# Altium project CM3_IO_V1.3_20220328.PrjPcb
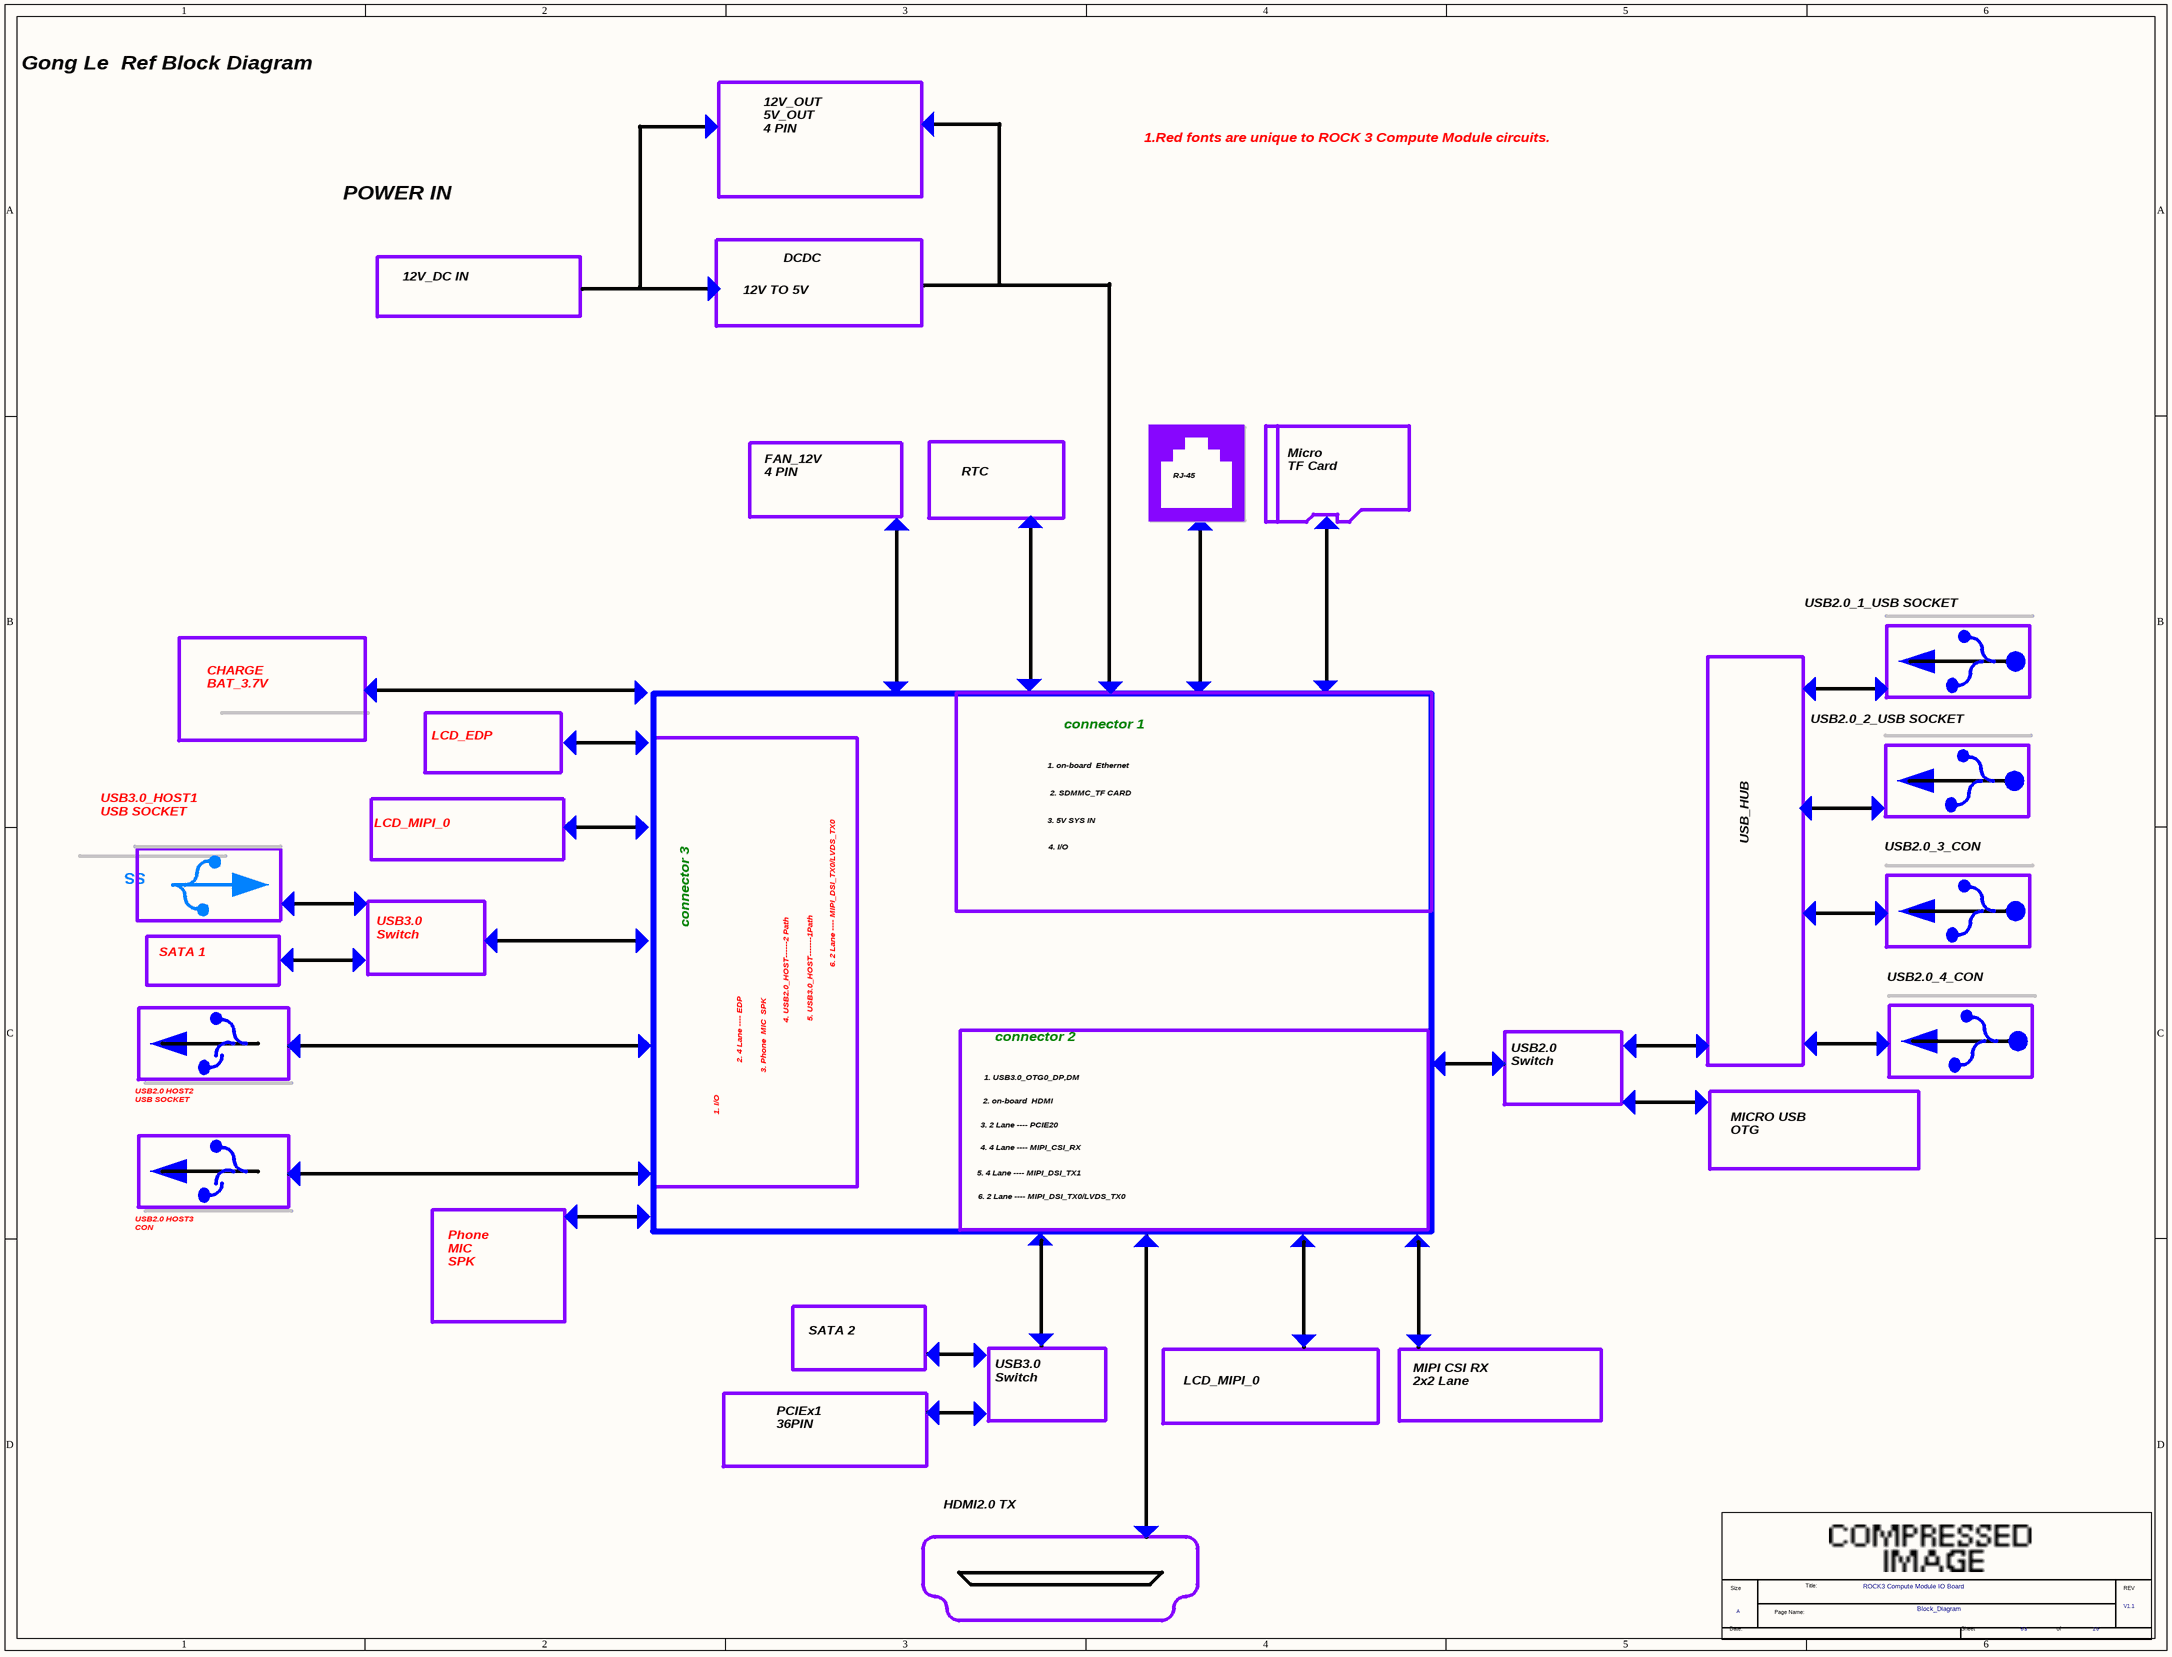
[diagram p0: 03.SchDoc]
5 sheets, 138 parts. Net scope: global (net labels, ports and power ports of the same name join across sheets).
Sheets:
  03.SchDoc
  04.SchDoc
  09.SchDoc
  13.SchDoc
  14.SchDoc

## Sheet 03.SchDoc
size 459 x 350 mm

### Parts
(Parts that share a designator on the sheet are numbered #1, #2 ... from top to bottom, then left to right.)
*#1  Page Count: 20  Page Number: 03  Page Size: A  Title: ROCK3 Compute Module IO Board  RevCode: V1.1  Doc: Block_Diagram  (hidden comment: radxa_gong)  (graphical)

### Notes on the sheet
- Gong Le  Ref Block Diagram
- 12V_OUT
  5V_OUT
  4 PIN
- 1.Red fonts are unique to ROCK 3 Compute Module circuits.
- POWER IN
- 12V_DC IN
- 12V TO 5V
- DCDC
- FAN_12V
  4 PIN
- RTC
- RJ-45
- Micro
  TF Card
- CHARGE
  BAT_3.7V
- USB2.0_1_USB SOCKET
- LCD_EDP
- 1. on-board  Ethernet
- connector 1
- USB2.0_2_USB SOCKET
- USB3.0_HOST1
  USB SOCKET
- LCD_MIPI_0
- 3. 5V SYS IN
- 2. SDMMC_TF CARD
- USB_HUB
- SS
- 4. I/O
- USB2.0_3_CON
- SATA 1
- USB3.0
  Switch
- connector 3
- 5. USB3.0_HOST-------1Path
- 6. 2 Lane ---- MIPI_DSI_TX0/LVDS_TX0
- USB2.0_4_CON
- 2. 4 Lane ---- EDP
- 3. Phone  MIC  SPK
- 4. USB2.0_HOST------2 Path
- 1. USB3.0_OTG0_DP,DM
- connector 2
- USB2.0
  Switch
- USB2.0 HOST2
  USB SOCKET
- 1. I/O
- 3. 2 Lane ---- PCIE20
- 2. on-board  HDMI
- MICRO USB
  OTG
- 5. 4 Lane ---- MIPI_DSI_TX1
- 4. 4 Lane ---- MIPI_CSI_RX
- USB2.0 HOST3
  CON
- Phone
  MIC
  SPK
- SATA 2
- MIPI CSI RX
  2x2 Lane
- PCIEx1
  36PIN
- HDMI2.0 TX
- (in symbol radxa_gong) Size; Title:; REV; Page Name:; Date:; Sheet; of

### Library data of the parts
*#1 = radxa_gong: Page Create Date: March  8, 1995

## Sheet 04.SchDoc
size 297 x 209 mm
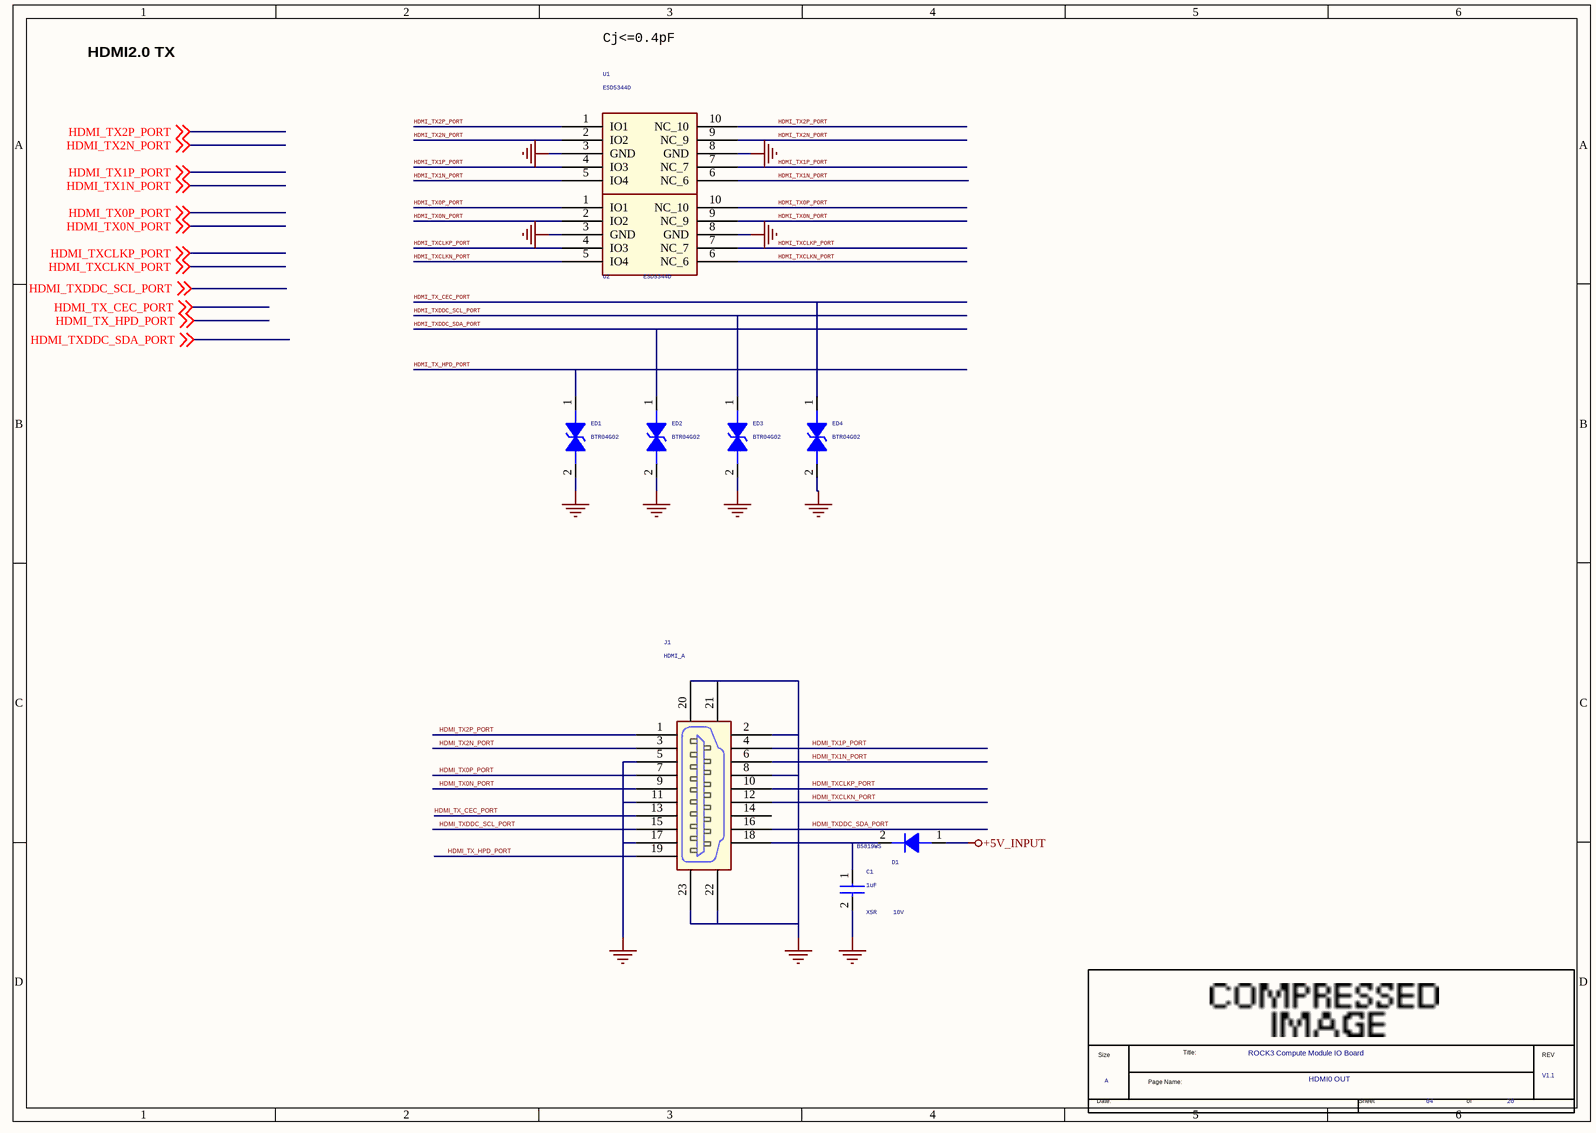
[diagram p1: 04.SchDoc]

### Parts
(Parts that share a designator on the sheet are numbered #1, #2 ... from top to bottom, then left to right.)
*#2  Page Count: 20  Page Number: 04  Page Size: A  Title: ROCK3 Compute Module IO Board  RevCode: V1.1  Doc: HDMI0 OUT  (hidden comment: radxa_gong)  (graphical)
C1  1uF  Voltage: 10V  Dielectric: X5R  [C0402]
D1  B5819WS  [SOD_323]
ED1  BTR04G02  [ESD0402_1xD5]
ED2  BTR04G02  [ESD0402_1xD5]
ED3  BTR04G02  [ESD0402_1xD5]
ED4  BTR04G02  [ESD0402_1xD5]
J1  HDMI_A  [HDMIA19S]
U1  ESD5344D  [SON10_2R50X1R00X0R50]
U2  ESD5344D  [SON10_2R50X1R00X0R50]

### Nets
+5V_INPUT: D1.1(A)
GND: C1.2 ED1.2 ED2.2 ED3.2 ED4.2 J1.2 J1.5 J1.8 J1.11 J1.17 J1.20 J1.21 J1.22 J1.23 U1.3(GND) U1.8(GND) U2.3(GND) U2.8(GND)
HDMI_TX0N_PORT: J1.9 U2.2(IO2) U2.9(NC_9) ; off-sheet HDMI_TX0N_PORT
HDMI_TX0P_PORT: J1.7 U2.1(IO1) U2.10(NC_10) ; off-sheet HDMI_TX0P_PORT
HDMI_TX1N_PORT: J1.6 U1.5(IO4) U1.6(NC_6) ; off-sheet HDMI_TX1N_PORT
HDMI_TX1P_PORT: J1.4 U1.4(IO3) U1.7(NC_7) ; off-sheet HDMI_TX1P_PORT
HDMI_TX2N_PORT: J1.3 U1.2(IO2) U1.9(NC_9) ; off-sheet HDMI_TX2N_PORT
HDMI_TX2P_PORT: J1.1($PIN0) U1.1(IO1) U1.10(NC_10) ; off-sheet HDMI_TX2P_PORT
HDMI_TX_CEC_PORT: ED4.1 J1.13 ; off-sheet HDMI_TX_CEC_PORT
HDMI_TX_HPD_PORT: ED1.1 J1.19 ; off-sheet HDMI_TX_HPD_PORT
HDMI_TXCLKN_PORT: J1.12 U2.5(IO4) U2.6(NC_6) ; off-sheet HDMI_TXCLKN_PORT
HDMI_TXCLKP_PORT: J1.10 U2.4(IO3) U2.7(NC_7) ; off-sheet HDMI_TXCLKP_PORT
HDMI_TXDDC_SCL_PORT: ED3.1 J1.15 ; off-sheet HDMI_TXDDC_SCL_PORT
HDMI_TXDDC_SDA_PORT: ED2.1 J1.16 ; off-sheet HDMI_TXDDC_SDA_PORT
NetC1_1: C1.1 D1.2(K) J1.18

Not connected (* = marked no-connect by the designer): J1 14

### Notes on the sheet
- HDMI2.0 TX
- Cj<=0.4pF
- (in symbol radxa_gong) Size; Title:; REV; Page Name:; Date:; Sheet; of

### Library data of the parts
C1 = CAP NP_Dup2: cap,1.00uF,+/-10%,10V,X5R,C0402; Manufacturer PN: C1005X5R1A105K050BB; Manufacturer: TDK; Tolerance: 10%; Priority: A; Created by: JJJ; Part Type: C0402; RK PN: C1005X5R1A105K050BB
D1 = DIODE_Dup2: Schottky Barrier，B5819WS SOD-323; Manufacturer: 长电; Priority: A; RK PN: B5819WS; Part Type: Schottky rectifier; Manufacturer PN: B5819WS; Created by: JJJ
ED1-ED4 = DIODE BI_DIR TRIG: 1-Line, Bi-directional, Transient Voltage Suppressors.17.5pF.; Manufacturer: WillSemi(韦尔半导体); RK PN: ESD5451N; Priority: A; Part Type: ESD_TVS; Manufacturer PN: ESD5451N; Created by: JJJ
J1 = HDMI_A: 通用A型HDMI座,卧式,侧插; Manufacturer: 旺科达; Priority: A; RK PN: HDMI_A; Part Type: HDMI Jack; Manufacturer Part Number: HDMI_A; Created by: JJJ
U1 U2 = ESD_ESD5304D: 4-Lines, Uni-directional, Ultra-low Capacitance Transient Voltage Suppressors; Manufacturer: WillSemi(韦尔半导体); Priority: A; Created by: JJJ; Manufacturer PN: ESD5304D; Part Type: ESD_TVS; RK PN: ESD5304D
*#2 = radxa_gong: Page Create Date: March  8, 1995

## Sheet 09.SchDoc
size 297 x 209 mm
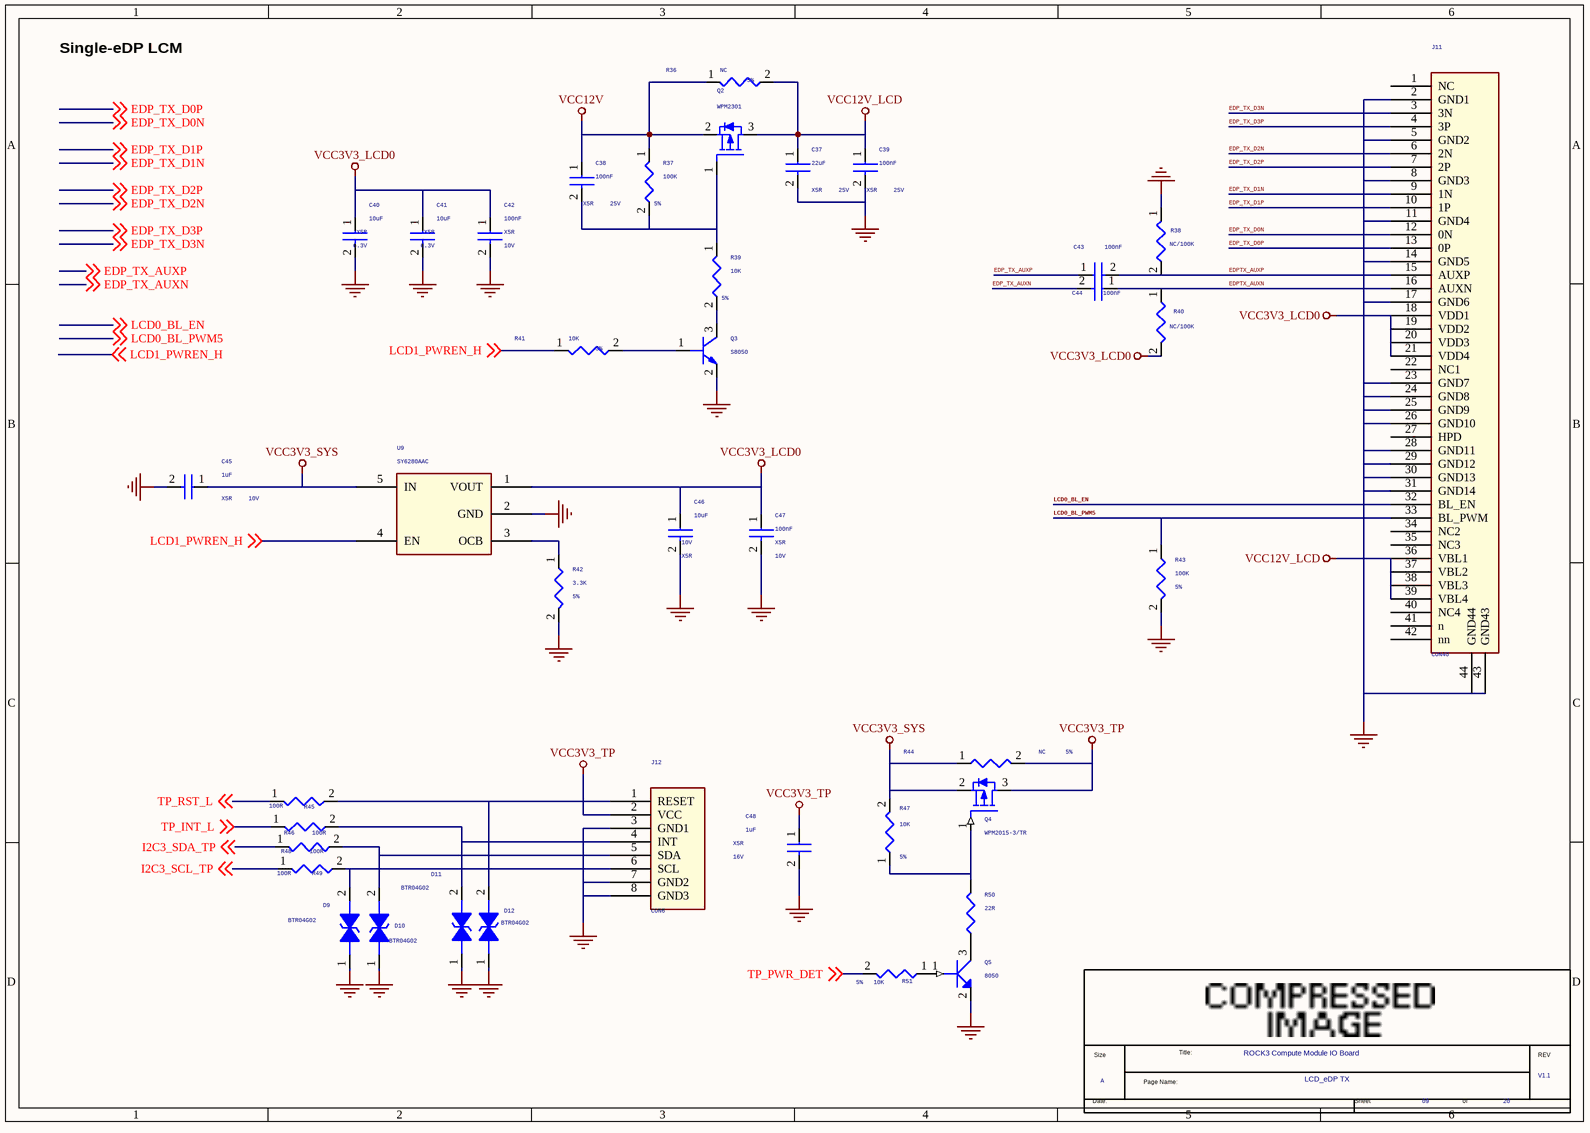
[diagram p2: 09.SchDoc]

### Parts
(Parts that share a designator on the sheet are numbered #1, #2 ... from top to bottom, then left to right.)
*#3  Page Count: 20  Page Number: 09  Page Size: A  Title: ROCK3 Compute Module IO Board  RevCode: V1.1  Doc: LCD_eDP TX  (hidden comment: radxa_gong)  (graphical)
C37  22uF  Voltage: 25V  Dielectric: X5R  [C0805]
C38  100nF  Voltage: 25V  Dielectric: X5R  [C0402]
C39  100nF  Voltage: 25V  Dielectric: X5R  [C0402]
C40  10uF  Voltage: 6.3V  Dielectric: X5R  [C0603]
C41  10uF  Voltage: 6.3V  Dielectric: X5R  [C0603]
C42  100nF  Voltage: 10V  Dielectric: X5R  [C0402]
C43  100nF  [C0402]
C44  100nF  [C0402]
C45  1uF  Voltage: 10V  Dielectric: X5R  [C0402]
C46  10uF  Voltage: 10V  Dielectric: X5R  [C0603]
C47  100nF  Voltage: 10V  Dielectric: X5R  [C0402]
C48  1uF  Voltage: 16V  Dielectric: X5R  [C0402]
D9  BTR04G02  [ESD0402_1xD5]
D10  BTR04G02  [ESD0402_1xD5]
D11  BTR04G02  [ESD0402_1xD5]
D12  BTR04G02  [ESD0402_1xD5]
J11  CON40  [20455-040E-TOP]
J12  CON6  [FPC6-0.5MM-2660H]
Q2  WPM2301  [SOT23]
Q3  S8050  [SOT23]
Q4  WPM2015-3/TR  [SOT23]
Q5  8050  [SOT23]
R36  NC  Tolerance: 5%  [R0402]
R37  100K  Tolerance: 5%  [R0402]
R38  NC/100K  [R0402]
R39  10K  Tolerance: 5%  [R0402]
R40  NC/100K  [R0402]
R41  10K  Tolerance: 5%  [R0402]
R42  3.3K  Tolerance: 5%  [R0402]
R43  100K  Tolerance: 5%  [R0402]
R44  NC  Tolerance: 5%  [R0402]
R45  100R  [R0402]
R46  100R  [R0402]
R47  10K  Tolerance: 5%  [R0402]
R48  100R  [R0402]
R49  100R  [R0402]
R50  22R  [R0402]
R51  10K  Tolerance: 5%  [R0402]
U9  SY6280AAC  [SOT_23_5]

### Nets
GND: C37.2 C39.2 C40.2 C41.2 C42.2 C45.2 C46.2 C47.2 C48.2 D9.1 D10.1 D11.1 D12.1 J11.2(GND1) J11.5(GND2) J11.8(GND3) J11.11(GND4) J11.14(GND5) J11.17(GND6) J11.23(GND7) J11.24(GND8) J11.25(GND9) J11.26(GND10) J11.28(GND11) J11.29(GND12) J11.30(GND13) J11.31(GND14) J11.43(GND43) J11.44(GND44) J12.3(GND1) J12.7(GND2) J12.8(GND3) Q3.2(EMITTER) Q5.2(E) R38.1 R42.2 R43.2 U9.2(GND)
VCC3V3_LCD0: C40.1 C41.1 C42.1 C46.1 C47.1 J11.18(VDD1) J11.19(VDD2) J11.20(VDD3) J11.21(VDD4) R40.2 U9.1(VOUT)
VCC3V3_SYS: C45.1 Q4.2(SOURCE) R44.1 R47.2 U9.5(IN)
VCC3V3_TP: C48.1 J12.2(VCC) Q4.3(DRAIN) R44.2
VCC12V: C38.1 Q2.2(SOURCE) R36.1 R37.1
VCC12V_LCD: C37.1 C39.1 J11.36(VBL1) J11.37(VBL2) J11.38(VBL3) J11.39(VBL4) Q2.3(DRAIN) R36.2
EDP_TX_AUXN: C44.2 ; off-sheet EDP_TX_AUXN
EDP_TX_AUXP: C43.1 ; off-sheet EDP_TX_AUXP
EDP_TX_D0N: J11.12(0N) ; off-sheet EDP_TX_D0N
EDP_TX_D0P: J11.13(0P) ; off-sheet EDP_TX_D0P
EDP_TX_D1N: J11.9(1N) ; off-sheet EDP_TX_D1N
EDP_TX_D1P: J11.10(1P) ; off-sheet EDP_TX_D1P
EDP_TX_D2N: J11.6(2N) ; off-sheet EDP_TX_D2N
EDP_TX_D2P: J11.7(2P) ; off-sheet EDP_TX_D2P
EDP_TX_D3N: J11.3(3N) ; off-sheet EDP_TX_D3N
EDP_TX_D3P: J11.4(3P) ; off-sheet EDP_TX_D3P
EDPTX_AUXN: C44.1 J11.16(AUXN) R40.1
EDPTX_AUXP: C43.2 J11.15(AUXP) R38.2
I2C3_SCL_TP: R49.1 ; off-sheet I2C3_SCL_TP
I2C3_SDA_TP: R48.1 ; off-sheet I2C3_SDA_TP
LCD0_BL_EN: J11.32(BL_EN) ; off-sheet LCD0_BL_EN
LCD0_BL_PWM5: J11.33(BL_PWM) R43.1 ; off-sheet LCD0_BL_PWM5
LCD1_PWREN_H: R41.1 U9.4(EN) ; off-sheet LCD1_PWREN_H
TP_INT_L: R46.1 ; off-sheet TP_INT_L
TP_PWR_DET: R51.2 ; off-sheet TP_PWR_DET
TP_RST_L: R45.1 ; off-sheet TP_RST_L
NetC38_2: C38.2 Q2.1(GATE) R37.2 R39.1
NetD9_2: D9.2 J12.6(SCL) R49.2
NetD10_2: D10.2 J12.5(SDA) R48.2
NetD11_2: D11.2 J12.4(INT) R46.2
NetD12_2: D12.2 J12.1(RESET) R45.2
NetQ3_1: Q3.1(BASE) R41.2
NetQ3_3: Q3.3(COLLECTOR) R39.2
NetQ4_1: Q4.1(GATE) R47.1 R50.2
NetQ5_1: Q5.1(B) R51.1
NetQ5_3: Q5.3(C) R50.1
NetR42_1: R42.1 U9.3(OCB)

Not connected (* = marked no-connect by the designer): J11 1(NC) 22(NC1) 27(HPD) 34(NC2) 35(NC3) 40(NC4) 41(n) 42(nn)

### Notes on the sheet
- Single-eDP LCM
- (in symbol radxa_gong) Size; Title:; REV; Page Name:; Date:; Sheet; of

### Library data of the parts
C37 C40 C41 = CAP NP_Dup2: cap,10.00uF,+/-10%,6.3V,X5R,C0603; Manufacturer PN: C1608X5R0J106K080AB; Manufacturer: TDK; Tolerance: 10%; Priority: A; Created by: JJJ; Part Type: C0603; RK PN: C1608X5R0J106K080AB
  C40 C41: C_Voltage: 6.3V
C38 = CAP NP_Dup2: cap,100.00nF,+/-10%,16V,X5R,C0402; Manufacturer: TDK; RK PN: C1005X5R1C104K050BA; Priority: A; Tolerance: 10%; Part Type: C0402; Manufacturer PN: C1005X5R1C104K050BA; Created by: JJJ
C39 = CAP NP_Dup2: cap,100.00nF,+/-10%,16V,X5R,C0402; Manufacturer PN: C1005X5R1C104K050BA; Manufacturer: TDK; Tolerance: 10%; Priority: A; Created by: JJJ; Part Type: C0402; RK PN: C1005X5R1C104K050BA
C42 C43 = CAP NP_Dup2: cap,100.00nF,+/-10%,10V,X5R,C0402; Manufacturer: TDK; RK PN: C1005X5R1A104K050BA; Priority: A; Tolerance: 10%; Part Type: C0402; Manufacturer PN: C1005X5R1A104K050BA; Created by: JJJ
  C43: Voltage: 10V; Dielectric: X5R
C44 C47 = CAP NP_Dup2: cap,100.00nF,+/-10%,10V,X5R,C0402; Manufacturer PN: C1005X5R1A104K050BA; Manufacturer: TDK; Tolerance: 10%; Priority: A; Created by: JJJ; Part Type: C0402; RK PN: C1005X5R1A104K050BA
  C44: Voltage: 10V; Dielectric: X5R
C45 = CAP NP_Dup2: cap,1.00uF,+/-10%,10V,X5R,C0402; Manufacturer PN: C1005X5R1A105K050BB; Manufacturer: TDK; Tolerance: 10%; C_Voltage: 6.3V; Priority: A; Created by: JJJ; Part Type: C0402; RK PN: C1005X5R1A105K050BB
C46 = CAP NP_Dup2: cap,10.00uF,+/-10%,10V,X5R,C0603; Manufacturer: TDK; RK PN: C1608X5R1A106K080AC; Priority: A; Tolerance: 10%; Part Type: C0603; Manufacturer PN: C1608X5R1A106K080AC; Created by: JJJ
C48 = CAP NP_Dup2: cap,100.00nF,+/-10%,6.3V,X5R,C0402; Manufacturer PN: C1005X5R0J104K050BA; Manufacturer: TDK; Tolerance: 10%; Priority: A; Created by: JJJ; Part Type: C0402; RK PN: C1005X5R0J104K050BA
D9 D11 D12 = DIODE BI_DIR TRIG: 1-Line, Bi-directional, Transient Voltage Suppressors.17.5pF.; Manufacturer: WillSemi(韦尔半导体); RK PN: ESD5451N; Priority: A; OPTION: DNP; Part Type: ESD_TVS; Manufacturer PN: ESD5451N; Created by: JJJ
D10 = DIODE BI_DIR TRIG: 1-Line, Bi-directional, Transient Voltage Suppressors.17.5pF.; Manufacturer PN: ESD5451N; Manufacturer: WillSemi(韦尔半导体); OPTION: DNP; Priority: A; Created by: JJJ; Part Type: ESD_TVS; RK PN: ESD5451N
J11 = CON40_1
J12 = CON6_1
Q2 = MOSFET P_Dup1: PMOS,WPM3407-3/TR,SOT_23,Id=4.4A,Vds=30V; Manufacturer: WillSemi(韦尔半导体); Pd: 0.9W; Vgsth: 2.0V; VDS: 30V; Vgs: ±20V; Id_max: 4.4A; Priority: A; Created by: JJJ; Manufacturer PN: WPM3407-3/TR; Part Type: PMOS; RK PN: WPM3407-3/TR
Q3 = NPN: S8050,SOT23; Manufacturer PN: S8050_SOT23; Manufacturer: 长电; Pc: 0.3W; Vceo: 25V; Ic: 0.5A; Priority: A; Created by: JJJ; Part Type: NPN; RK PN: S8050
Q4 = MOSFET P: PMOS,WPM2015-3/TR,SOT_23,Id=2.4A,Vds=20V; Manufacturer: WillSemi(韦尔半导体); ROOM: CHG; Priority: A; Id_max: 2.4A; Vgs: ±8V; VDS: 20V; Vgsth: 0.62V; Pd: 0.5W; option: DNP; RK PN: WPM2015-3/TR; Part Type: PMOS; Manufacturer PN: WPM2015-3/TR; Created by: JJJ
Q5 = NPN4
R36 R41 R47 = RESISTOR_Dup1: 通用厚膜电阻,10K,+/-5%,R0402,1/16W.; Manufacturer PN: RC0402JR-0710KL; Manufacturer: YAGEO; Wattage: 1/16W; Priority: A; Created by: YTL; Part Type: 通用厚膜电阻; RK PN: RC0402JR-0710KL
R37 R43 = RESISTOR_Dup1: 通用厚膜电阻,100K,+/-5%,R0402,1/16W.; Manufacturer PN: RC0402JR-07100KL; Manufacturer: YAGEO; Wattage: 1/16W; Priority: A; Created by: YTL; Part Type: 通用厚膜电阻; RK PN: RC0402JR-07100KL
R38 = RESISTOR_Dup1: 通用厚膜电阻,100K,+/-5%,R0402,1/16W.; Manufacturer: YAGEO; Tolerance: 5%; RK PN: RC0402JR-07100KL; Priority: A; Wattage: 1/16W; Option: DNP; Part Type: 通用厚膜电阻; Manufacturer PN: RC0402JR-07100KL; Created by: YTL
R39 = RESISTOR_Dup1: 通用厚膜电阻,10K,+/-5%,R0402,1/16W.; Manufacturer: YAGEO; RK PN: RC0402JR-0710KL; Priority: A; Wattage: 1/16W; Part Type: 通用厚膜电阻; Manufacturer PN: RC0402JR-0710KL; Created by: YTL
R40 = RESISTOR_Dup1: 通用厚膜电阻,100K,+/-5%,R0402,1/16W.; Manufacturer PN: RC0402JR-07100KL; Manufacturer: YAGEO; Tolerance: 5%; Wattage: 1/16W; Priority: A; Option: DNP; Created by: YTL; Part Type: 通用厚膜电阻; RK PN: RC0402JR-07100KL
R42 = RESISTOR_Dup1: 通用厚膜电阻,4K7,+/-5%,R0402,1/16W.; Manufacturer: YAGEO; RK PN: RC0402JR-074K7L; Priority: A; Wattage: 1/16W; Part Type: 通用厚膜电阻; Manufacturer PN: RC0402JR-074K7L; Created by: YTL
R44 = RESISTOR_Dup1: 通用厚膜电阻,0R,+/-5%,R0402,1/16W.; Manufacturer: YAGEO; RK PN: RC0402JR-070RL; Priority: A; Wattage: 1/16W; Part Type: 通用厚膜电阻; Manufacturer PN: RC0402JR-070RL; Created by: YTL
R45 R46 = RESISTOR_Dup1: 通用厚膜电阻,100K,+/-5%,R0402,1/16W.; Manufacturer: YAGEO; Tolerance: 5%; RK PN: RC0402JR-07100KL; Priority: A; Wattage: 1/16W; Part Type: 通用厚膜电阻; Manufacturer PN: RC0402JR-07100KL; Created by: YTL
R48 R49 = RESISTOR_Dup1: 通用厚膜电阻,100K,+/-5%,R0402,1/16W.; Manufacturer PN: RC0402JR-07100KL; Manufacturer: YAGEO; Tolerance: 5%; Wattage: 1/16W; Priority: A; Created by: YTL; Part Type: 通用厚膜电阻; RK PN: RC0402JR-07100KL
R50 = RESISTOR_0
R51 = RESISTOR_Dup1: 通用厚膜电阻,100K,+/-5%,R0402,1/16W.; Manufacturer: YAGEO; RK PN: RC0402JR-07100KL; Priority: A; Wattage: 1/16W; Part Type: 通用厚膜电阻; Manufacturer PN: RC0402JR-07100KL; Created by: YTL
U9 = SWITCH_SY6280: Low Loss Power Distribution Switch; Manufacturer: Silergy（矽力杰）; Priority: A; RK PN: SY6280AAC; Part Type: Switch; Manufacturer PN: SY6280AAC; Created by: JJJ
*#3 = radxa_gong: Page Create Date: March  8, 1995

## Sheet 13.SchDoc
size 386 x 246 mm
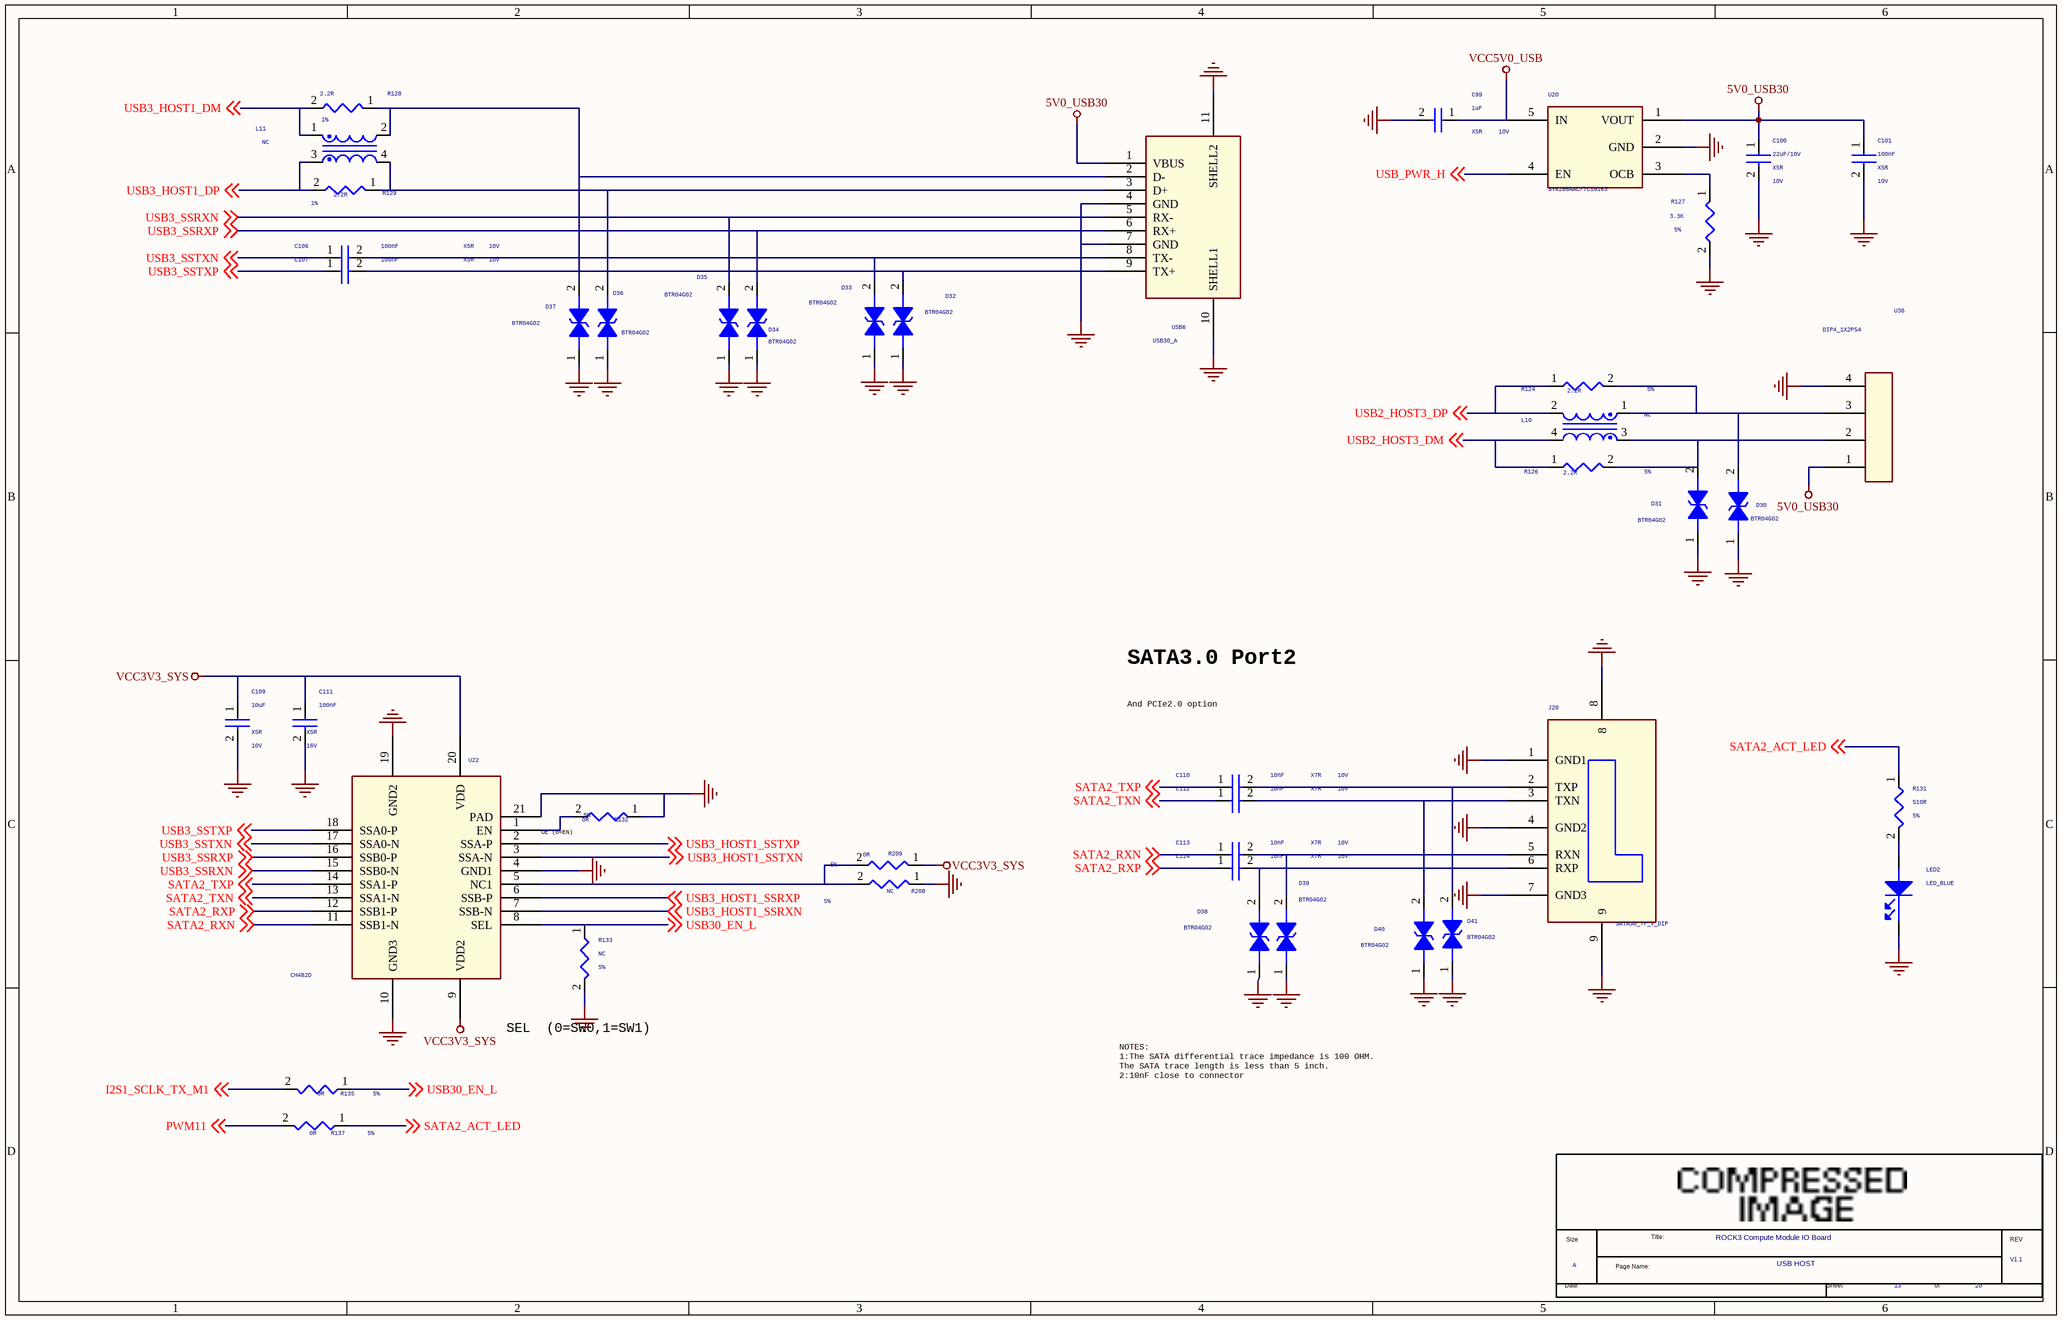
[diagram p3: 13.SchDoc]

### Parts
(Parts that share a designator on the sheet are numbered #1, #2 ... from top to bottom, then left to right.)
*#4  Page Count: 20  Page Number: 13  Page Size: A  Title: ROCK3 Compute Module IO Board  RevCode: V1.1  Doc: USB HOST  (hidden comment: radxa_gong)  (graphical)
C99  1uF  Voltage: 10V  Dielectric: X5R  [C0402]
C100  22uF/10V  Voltage: 10V  Dielectric: X5R  [C0603]
C101  100nF  Voltage: 10V  Dielectric: X5R  [C0402]
C106  100nF  Voltage: 10V  Dielectric: X5R  [C0402]
C107  100nF  Voltage: 10V  Dielectric: X5R  [C0402]
C109  10uF  Voltage: 10V  Dielectric: X5R  [C0603]
C110  10nF  Voltage: 10V  Dielectric: X7R  [C0402]
C111  100nF  Voltage: 16V  Dielectric: X5R  [C0402]
C112  10nF  Voltage: 10V  Dielectric: X7R  [C0402]
C113  10nF  Voltage: 10V  Dielectric: X7R  [C0402]
C114  10nF  Voltage: 10V  Dielectric: X7R  [C0402]
D30  BTR04G02  [ESD0402_1xD5]
D31  BTR04G02  [ESD0402_1xD5]
D32  BTR04G02  [ESD0402_1xD5]
D33  BTR04G02  [ESD0402_1xD5]
D34  BTR04G02  [ESD0402_1xD5]
D35  BTR04G02  [ESD0402_1xD5]
D36  BTR04G02  [ESD0402_1xD5]
D37  BTR04G02  [ESD0402_1xD5]
D38  BTR04G02  [ESD0402_1xD5]
D39  BTR04G02  [ESD0402_1xD5]
D40  BTR04G02  [ESD0402_1xD5]
D41  BTR04G02  [ESD0402_1xD5]
J20  SATA30_7P_V_DIP  [SMD_SATA_7P_50_180]
L10  NC  [L0402D]
L11  NC  [L0402D]
LED2  LED_BLUE  [LED0603]
R124  2.2R  Tolerance: 5%  [R0402]
R126  2.2R  Tolerance: 5%  [R0402]
R127  3.3K  Tolerance: 5%  [R0402]
R128  2.2R  Tolerance: 1%  [R0402]
R129  2.2R  Tolerance: 1%  [R0402]
R131  510R  Tolerance: 5%  [R0402]
R132  0R  Tolerance: 5%  [R0402]
R133  NC  Tolerance: 5%  [R0402]
R135  0R  Tolerance: 5%  [R0402]
R137  0R  Tolerance: 5%  [R0402]
R208  NC  Tolerance: 5%  [R0402]
R209  0R  Tolerance: 5%  [R0402]
U20  SY6280AAC/TCS9163  [SOT_23_5]
U22  CH482D  [CH482X]
U36  DIP4_1X2P54  [DIP4_1X2P54]
USB6  USB30_A  [USB30]

### Nets
5V0_USB30: C100.1 C101.1 U20.1(VOUT) U36.1 USB6.1(VBUS)
GND: C99.2 C100.2 C101.2 C109.2 C111.2 D30.1 D31.1 D32.1 D33.1 D34.1 D35.1 D36.1 D37.1 D38.1 D39.1 D40.1 D41.1 J20.1(GND1) J20.4(GND2) J20.7(GND3) J20.8 J20.9 LED2.2(CATHODE) R127.2 R132.1 R133.2 R208.1 U20.2(GND) U22.4(GND1) U22.10(GND3) U22.19(GND2) U22.21(PAD) U36.4 USB6.4(GND) USB6.7(GND) USB6.10(SHELL1) USB6.11(SHELL2)
VCC3V3_SYS: C109.1 C111.1 R209.1 U22.9(VDD2) U22.20(VDD)
VCC5V0_USB: C99.1 U20.5(IN)
I2S1_SCLK_TX_M1: R135.2 ; off-sheet I2S1_SCLK_TX_M1
PWM11: R137.2 ; off-sheet PWM11
SATA2_ACT_LED: R131.1 R137.1 ; off-sheet SATA2_ACT_LED
SATA2_RXN: C113.1 U22.11(SSB1-N) ; off-sheet SATA2_RXN
SATA2_RXP: C114.1 U22.12(SSB1-P) ; off-sheet SATA2_RXP
SATA2_TXN: C112.1 U22.13(SSA1-N) ; off-sheet SATA2_TXN
SATA2_TXP: C110.1 U22.14(SSA1-P) ; off-sheet SATA2_TXP
USB2_HOST3_DM: L10.4 R126.1 ; off-sheet USB2_HOST3_DM
USB2_HOST3_DP: L10.2 R124.1 ; off-sheet USB2_HOST3_DP
USB3_HOST1_DM: L11.1 R128.2 ; off-sheet USB3_HOST1_DM
USB3_HOST1_DP: L11.3 R129.2 ; off-sheet USB3_HOST1_DP
USB3_HOST1_SSRXN: U22.7(SSB-N) ; off-sheet USB3_HOST1_SSRXN
USB3_HOST1_SSRXP: U22.6(SSB-P) ; off-sheet USB3_HOST1_SSRXP
USB3_HOST1_SSTXN: U22.3(SSA-N) ; off-sheet USB3_HOST1_SSTXN
USB3_HOST1_SSTXP: U22.2(SSA-P) ; off-sheet USB3_HOST1_SSTXP
USB3_SSRXN: D35.2 U22.15(SSB0-N) USB6.5(RX-) ; off-sheet USB3_SSRXN
USB3_SSRXP: D34.2 U22.16(SSB0-P) USB6.6(RX+) ; off-sheet USB3_SSRXP
USB3_SSTXN: C106.1 U22.17(SSA0-N) ; off-sheet USB3_SSTXN
USB3_SSTXP: C107.1 U22.18(SSA0-P) ; off-sheet USB3_SSTXP
USB30_EN_L: R133.1 R135.1 U22.8(SEL) ; off-sheet USB30_EN_L
USB_PWR_H: U20.4(EN) ; off-sheet USB_PWR_H
NetC106_2: C106.2 D33.2 USB6.8(TX-)
NetC107_2: C107.2 D32.2 USB6.9(TX+)
NetC110_2: C110.2 D41.2 J20.2(TXP)
NetC112_2: C112.2 D40.2 J20.3(TXN)
NetC113_2: C113.2 D39.2 J20.5(RXN)
NetC114_2: C114.2 D38.2 J20.6(RXP)
NetD30_2: D30.2 L10.1 R124.2 U36.3
NetD31_2: D31.2 L10.3 R126.2 U36.2
NetD36_2: D36.2 L11.4 R129.1 USB6.3(D+)
NetD37_2: D37.2 L11.2 R128.1 USB6.2(D-)
NetLED2_1: LED2.1(ANODE) R131.2
NetR127_1: R127.1 U20.3(OCB)
NetR132_2: R132.2 U22.1(EN)
NetR208_2: R208.2 R209.2 U22.5(NC1)

### Notes on the sheet
- SATA3.0 Port2
- And PCIe2.0 option
- (near R132) OE (0=EN)
- SEL  (0=SW0,1=SW1)
- (near *#4) NOTES:
  1:The SATA differential trace impedance is 100 OHM.
  The SATA trace length is less than 5 inch.
  2:10nF close to connector
- (in symbol radxa_gong) Title:; Size; REV; Page Name:; Date:; Sheet; of

### Library data of the parts
C99 = CAP NP_Dup2: as C45 on sheet 09; Created by: JJJ; Part Type: C0402; RK PN: C1005X5R1A105K050BB
C100 = CAP NP_Dup2: as C42 on sheet 09; Part Type: C0402; Manufacturer PN: C1005X5R1A104K050BA; Created by: JJJ
C101 = CAP NP_Dup2: as C44 on sheet 09; Created by: JJJ; Part Type: C0402; RK PN: C1005X5R1A104K050BA
C106 = CAP NP_Dup2: cap,100.00nF,+/-10%,10V,X5R,C0201; Manufacturer PN: C0603X5R1A104K030BC; Manufacturer: TDK; Tolerance: 10%; Priority: A; Created by: JJJ; Part Type: C0201; RK PN: C0603X5R1A104K030BC
C107 = CAP NP_Dup2: cap,100.00nF,+/-10%,10V,X5R,C0201; Manufacturer: TDK; RK PN: C0603X5R1A104K030BC; Priority: A; Tolerance: 10%; Part Type: C0201; Manufacturer PN: C0603X5R1A104K030BC; Created by: JJJ
C109 = CAP NP_Dup2: cap,22.00uF,+/-10%,10V,X5R,C0805; Manufacturer: TDK; RK PN: C2012X5R1A226K125AB; Priority: A; Tolerance: 10%; Part Type: C0805; Manufacturer PN: C2012X5R1A226K125AB; Created by: JJJ
C110 C112-C114 = CAP NP_Dup2: cap,10.00nF,+/-10%,10V,X7R,C0201; Manufacturer PN: C0603X7R1A103K030BA; Manufacturer: TDK; Tolerance: 10%; Priority: A; Created by: JJJ; Part Type: C0201; RK PN: C0603X7R1A103K030BA
C111 = CAP NP_Dup2: as C38 on sheet 09; Part Type: C0402; Manufacturer PN: C1005X5R1C104K050BA; Created by: JJJ
D30 D31 D33 D34 D39 = DIODE BI_DIR TRIG: as D9 on sheet 09; Part Type: ESD_TVS; Manufacturer PN: ESD5451N; Created by: JJJ
D32 D35-D38 D40 D41 = DIODE BI_DIR TRIG: as D10 on sheet 09; Created by: JJJ; Part Type: ESD_TVS; RK PN: ESD5451N
J20 = SATA_DIP_1
L10 = INDUCTOR COM: Winding Type Common Mode Choke Coil; Manufacturer: sunlord; RK PN: SDCW2012-2-900TF; Priority: A; DC Resistor: 0.35ohm; Tolerance: 25%; Irms: 330mA; Resonace frequency: 90R@100M; Part Type: IND; Manufacturer PN: SDCW2012-2-900TF; Created by: JJJ
L11 = INDUCTOR COM: Winding Type Common Mode Choke Coil; Manufacturer PN: SDCW2012-2-900TF; Manufacturer: sunlord; Resonace frequency: 90R@100M; Irms: 330mA; Tolerance: 25%; DC Resistor: 0.35ohm; Priority: A; Created by: JJJ; Part Type: IND; RK PN: SDCW2012-2-900TF
LED2 = LED: 贴片LED灯，0603，红色; option: SATA2_ACT_LED; RK PN: LED_RED; Priority: A; Part Type: LED; Created by: JJJ
R124 R126 R209 = RESISTOR_Dup1: as R44 on sheet 09; Part Type: 通用厚膜电阻; Manufacturer PN: RC0402JR-070RL; Created by: YTL
R127 = RESISTOR_Dup1: 通用厚膜电阻,4K7,+/-5%,R0402,1/16W.; Manufacturer PN: RC0402JR-074K7L; Manufacturer: YAGEO; Wattage: 1/16W; Priority: A; Created by: YTL; Part Type: 通用厚膜电阻; RK PN: RC0402JR-074K7L
R128 R129 = RESISTOR_Dup1: 通用厚膜电阻,4K7,+/-1%,R0402,1/16W.; Manufacturer PN: RC0402FR-074K7L; Manufacturer: YAGEO; Wattage: 1/16W; Priority: A; Created by: YTL; Part Type: 通用厚膜电阻; RK PN: RC0402FR-074K7L
R131 = RESISTOR_Dup1: 通用厚膜电阻,510R,+/-5%,R0402,1/16W.; Manufacturer: YAGEO; RK PN: RC0402JR-07510RL; Priority: A; Wattage: 1/16W; Part Type: 通用厚膜电阻; Manufacturer PN: RC0402JR-07510RL; Created by: YTL
R132 R208 = RESISTOR_Dup1: 通用厚膜电阻,0R,+/-5%,R0402,1/16W.; Manufacturer PN: RC0402JR-070RL; Manufacturer: YAGEO; Wattage: 1/16W; Priority: A; Created by: YTL; Part Type: 通用厚膜电阻; RK PN: RC0402JR-070RL
R133 = RESISTOR_Dup1: as R42 on sheet 09; Part Type: 通用厚膜电阻; Manufacturer PN: RC0402JR-074K7L; Created by: YTL
R135 R137 = RESISTOR_Dup1: 通用厚膜电阻,100R,+/-5%,R0402,1/16W.; Manufacturer PN: RC0402JR-07100RL; Manufacturer: YAGEO; Wattage: 1/16W; Priority: A; Created by: YTL; Part Type: 通用厚膜电阻; RK PN: RC0402JR-07100RL
U20 = SWITCH_SY6280: as U9 on sheet 09; Created by: JJJ; Manufacturer PN: SY6280AAC; Part Type: Switch; RK PN: SY6280AAC
U22 = CH482X
U36 = CON3_5
USB6 = USB30_TYPE_A: A型USB3.0座，卧式，插焊; Manufacturer: 旺科达; Priority: A; RK PN: USB-HOST_30; Created by: JJJ; Manufacturer Part Number: USB30_A; Part Type: USB Jack
*#4 = radxa_gong: Page Create Date: March  8, 1995

## Sheet 14.SchDoc
size 297 x 209 mm
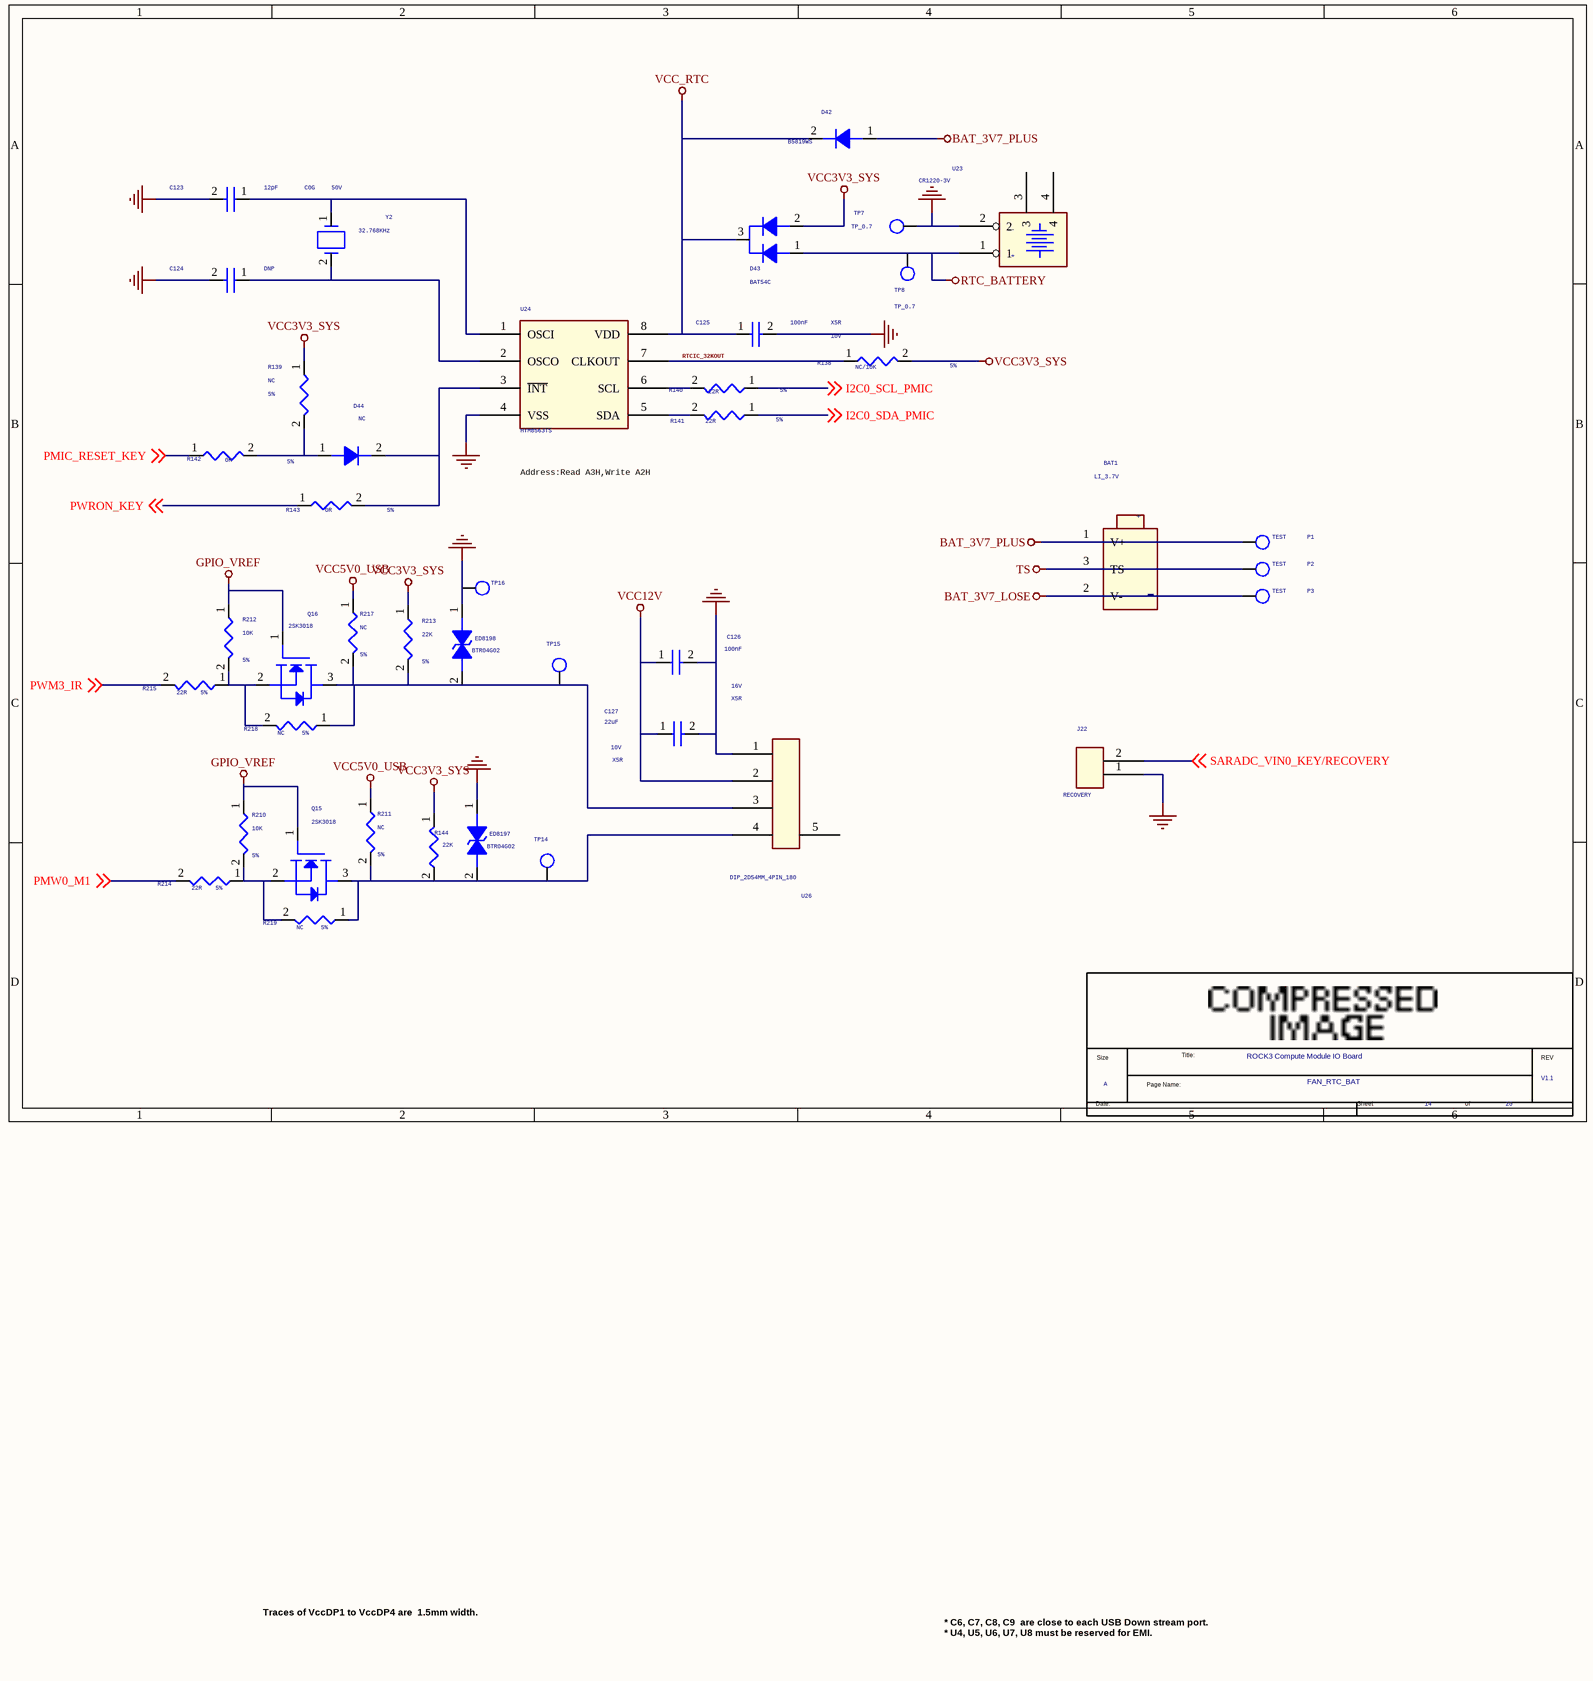
[diagram p4: 14.SchDoc]

### Parts
(Parts that share a designator on the sheet are numbered #1, #2 ... from top to bottom, then left to right.)
*#5  Page Count: 20  Page Number: 14  Page Size: A  Title: ROCK3 Compute Module IO Board  RevCode: V1.1  Doc: FAN_RTC_BAT  (hidden comment: radxa_gong)  (graphical)
BAT1  LI_3.7V  [SMD-3P-1.25]
C123  12pF  Voltage: 50V  Dielectric: C0G  [C0402]
C124  DNP  [C0402]
C125  100nF  Voltage: 10V  Dielectric: X5R  [C0402]
C126  100nF  Voltage: 16V  Dielectric: X5R  [C0402]
C127  22uF  Voltage: 10V  Dielectric: X5R  [C0603]
D42  B5819WS  [SOD_323]
D43  BAT54C  [SOT_23]
D44  NC  [SOD323]
ED8197  BTR04G02  [ESD0402_1xD5]
ED8198  BTR04G02  [ESD0402_1xD5]
J22  RECOVERY  [DIP2PIN-2P54MM]
P1  TEST  [TEST]
P2  TEST  [TEST]
P3  TEST  [TEST]
Q15  2SK3018  [SOT23]
Q16  2SK3018  [SOT23]
R138  NC/10K  Tolerance: 5%  [R0402]
R139  NC  Tolerance: 5%  [R0402]
R140  22R  Tolerance: 5%  [R0402]
R141  22R  Tolerance: 5%  [R0402]
R142  0R  Tolerance: 5%  [R0402]
R143  0R  Tolerance: 5%  [R0402]
R144  22K  [R0402]
R210  10K  Tolerance: 5%  [R0402]
R211  NC  Tolerance: 5%  [R0402]
R212  10K  Tolerance: 5%  [R0402]
R213  22K  Tolerance: 5%  [R0402]
R214  22R  Tolerance: 5%  [R0402]
R215  22R  Tolerance: 5%  [R0402]
R217  NC  Tolerance: 5%  [R0402]
R218  NC  Tolerance: 5%  [R0402]
R219  NC  Tolerance: 5%  [R0402]
TP7  TP_0.7  [TEST]
TP8  TP_0.7  [TEST]
TP14  TP_1.0  [TEST]  (value not drawn)
TP15  TP_1.0  [TEST]  (value not drawn)
TP16  TP_1.0  [TEST]  (value not drawn)
U23  CR1220-3V  [BATTERY-20MM]
U24  HYM8563TS  [MSOP8]
U26  DIP_2D54MM_4PIN_180  [470531000_4PIN]
Y2  32.768KHz  [CRY-3215]

### Nets
BAT_3V7_LOSE: BAT1.2(V-) P3.1
BAT_3V7_PLUS: BAT1.1(V+) D42.1(A) P1.1
GND: C123.2 C124.2 C125.2 C126.2 C127.2 ED8197.1 ED8198.1 J22.1 TP7.1 TP16.1 U23.2 U24.4(VSS) U26.1
GPIO_VREF: Q15.1(GATE) Q16.1(GATE) R210.1 R212.1
RTC_BATTERY: D43.1(A1) TP8.1 U23.1
TS: BAT1.3(TS) P2.1
VCC3V3_SYS: D43.2(A2) R138.2 R139.1 R144.1 R213.1
VCC5V0_USB: R211.1 R217.1
VCC12V: C126.1 C127.1 U26.2
VCC_RTC: C125.1 D42.2(K) D43.3(K) U24.8(VDD)
I2C0_SCL_PMIC: R140.1 ; off-sheet I2C0_SCL_PMIC
I2C0_SDA_PMIC: R141.1 ; off-sheet I2C0_SDA_PMIC
PMIC_RESET_KEY: R142.1 ; off-sheet PMIC_RESET_KEY
PMW0_M1: R214.2 ; off-sheet PMW0_M1
PWM3_IR: R215.2 ; off-sheet PWM3_IR
PWRON_KEY: R143.1 ; off-sheet PWRON_KEY
RTCIC_32KOUT: R138.1 U24.7(CLKOUT)
SARADC_VIN0_KEY/RECOVERY: J22.2 ; off-sheet SARADC_VIN0_KEY/RECOVERY
NetC123_1: C123.1 U24.1(OSCI) Y2.1
NetC124_1: C124.1 U24.2(OSCO) Y2.2
NetD44_1: D44.1(A) R139.2 R142.2
NetD44_2: D44.2(K) R143.2 U24.3(~{INT})
NetED8197_2: ED8197.2 Q15.3(DRAIN) R144.2 R211.2 R219.1 TP14.1 U26.4
NetED8198_2: ED8198.2 Q16.3(DRAIN) R213.2 R217.2 R218.1 TP15.1 U26.3
NetQ15_2: Q15.2(SOURCE) R210.2 R214.1 R219.2
NetQ16_2: Q16.2(SOURCE) R212.2 R215.1 R218.2
NetR140_2: R140.2 U24.6(SCL)
NetR141_2: R141.2 U24.5(SDA)

Not connected (* = marked no-connect by the designer): U23 3 4; U26 5

### Notes on the sheet
- Address:Read A3H,Write A2H
- Traces of VccDP1 to VccDP4 are  1.5mm width.
- * C6, C7, C8, C9  are close to each USB Down stream port.
  * U4, U5, U6, U7, U8 must be reserved for EMI.
- (in symbol BATTERY_1) +; -
- (in symbol CON_BATTERY-20MM_0) -; +
- (in symbol radxa_gong) Size; Title:; REV; Page Name:; Date:; Sheet; of

### Library data of the parts
BAT1 = BATTERY_1
C123 = CAP NP_Dup2: cap,12.00pF,+/-5%,50V,C0G,C0402; Manufacturer PN: C1005C0G1H120J050BA; Manufacturer: TDK; Tolerance: 5%; Priority: A; Created by: JJJ; Part Type: C0402; RK PN: C1005C0G1H120J050BA
C124 = CAP NP_Dup2: Did Not Place.; Manufacturer PN: DNPC0402; Priority: A; Created by: JJJ; Part Type: DNP; RK PN: DNPC0402
C125 = CAP NP_Dup2: cap,100.00nF,+/-10%,10V,X5R,C0402; Manufacturer PN: C1005X5R1A104K050BA; Manufacturer: TDK; C_Voltage: 6.3V; Tolerance: 10%; Priority: A; Number: 37; Created by: JJJ; Part Type: C0402; RK PN: C1005X5R1A104K050BA
C126 = CAP NP_Dup2: as C39 on sheet 09; Created by: JJJ; Part Type: C0402; RK PN: C1005X5R1C104K050BA
C127 = CAP NP_Dup2: cap,22.00uF,+/-10%,10V,X5R,C0805; Manufacturer PN: C2012X5R1A226K125AB; Manufacturer: TDK; Tolerance: 10%; Priority: A; Created by: JJJ; Part Type: C0805; RK PN: C2012X5R1A226K125AB
D42 D44 = DIODE_Dup2: as D1 on sheet 04; Created by: JJJ; Manufacturer PN: B5819WS; Part Type: Schottky rectifier; RK PN: B5819WS
D43 = DIODE Double: Dual Schottky barrier，BAT54C SOT-23 Schottky Barrier; Manufacturer: 长电; Priority: A; RK PN: BAT54C; Part Type: Schottky rectifier; Manufacturer PN: BAT54C; Created by: JJJ
ED8197 = DIODE BI_DIR TRIG: 1-Line, Bi-directional, Transient Voltage Suppressors.17.5pF.; Manufacturer PN: ESD5451N; Manufacturer: WillSemi(韦尔半导体); Priority: A; Created by: JJJ; Part Type: ESD_TVS; RK PN: ESD5451N
ED8198 = DIODE BI_DIR TRIG: as ED1 on sheet 04; Part Type: ESD_TVS; Manufacturer PN: ESD5451N; Created by: JJJ
J22 = CON2
P1-P3 = TESTPOINT1
Q15 Q16 = MOSFET N: NMOS,2SK3018,SOT_323,Id=0.1A,Vds=30V; Manufacturer: ROHM; Rds: 5ohm; Priority: A; Id_max: 0.1A; Vgs: 20V; VDS: 30V; Vgsth: 1.5V; Pd: 0.2W; RK PN: 2SK3018; Part Type: NMOS; Manufacturer PN: 2SK3018; Created by: JJJ
R138 R143 = RESISTOR_Dup1: 通用厚膜电阻,10K,+/-5%,R0402,1/16W.; Manufacturer PN: RC0402JR-0710KL; Manufacturer: YAGEO; option: DNP; Wattage: 1/16W; Priority: A; Created by: YTL; Part Type: 通用厚膜电阻; RK PN: RC0402JR-0710KL
R139 R142 = RESISTOR_Dup1: 通用厚膜电阻,10K,+/-5%,R0402,1/16W.; Manufacturer: YAGEO; RK PN: RC0402JR-0710KL; Priority: A; Wattage: 1/16W; option: DNP; Part Type: 通用厚膜电阻; Manufacturer PN: RC0402JR-0710KL; Created by: YTL
R140 R141 R214 R215 R219 = RESISTOR_Dup1: 通用厚膜电阻,47K,+/-5%,R0402,1/16W.; Manufacturer PN: RC0402JR-0747KL; Manufacturer: YAGEO; Wattage: 1/16W; Priority: A; Created by: YTL; Part Type: 通用厚膜电阻; RK PN: RC0402JR-0747KL
R144 = RESISTOR_Dup1: 通用厚膜电阻,47K,+/-5%,R0402,1/16W.; Manufacturer PN: RC0402JR-0747KL; Manufacturer: YAGEO; Tolerance: 1%; Wattage: 0402; Priority: A; Created by: YTL; Part Type: 通用厚膜电阻; RK PN: RC0402JR-0747KL
R210 R212 = RESISTOR_Dup1: as R39 on sheet 09; Part Type: 通用厚膜电阻; Manufacturer PN: RC0402JR-0710KL; Created by: YTL
R211 R213 = RESISTOR_Dup1: 通用厚膜电阻,1K5,+/-5%,R0402,1/16W.; Manufacturer PN: RC0402JR-071K5L; Manufacturer: YAGEO; Wattage: 1/16W; Priority: A; Created by: YTL; Part Type: 通用厚膜电阻; RK PN: RC0402JR-071K5L
R217 = RESISTOR_Dup1: 通用厚膜电阻,1K5,+/-5%,R0402,1/16W.; Manufacturer: YAGEO; RK PN: RC0402JR-071K5L; Priority: A; Wattage: 1/16W; Part Type: 通用厚膜电阻; Manufacturer PN: RC0402JR-071K5L; Created by: YTL
R218 = RESISTOR_Dup1: 通用厚膜电阻,47K,+/-5%,R0402,1/16W.; Manufacturer: YAGEO; RK PN: RC0402JR-0747KL; Priority: A; Wattage: 1/16W; Part Type: 通用厚膜电阻; Manufacturer PN: RC0402JR-0747KL; Created by: YTL
TP7 = TP: Test Point 0.7mm; Priority: A; RK PN: TESTPOINT_0R7; Created by: JJJ; Part Type: TP
TP8 = TP: Test Point 0.7mm; RK PN: TESTPOINT_0R7; Priority: A; Part Type: TP; Created by: JJJ
TP14 TP15 = TP: Test Point 1.0mm; RK PN: TESTPOINT_1R0; Priority: A; Part Type: TP; Created by: CZD
TP16 = TP: Test Point 1.0mm; Priority: A; RK PN: TESTPOINT_1R0; Created by: CZD; Part Type: TP
U23 = CON_BATTERY-20MM_0
U24 = RTC_HYM8563: I2C Real Time Clock/Calendar; Manufacturer: Haoyu（昊昱微电子）; Priority: A; Created by: JJJ; Manufacturer PN: HYM8563TS; Part Type: RTC; RK PN: HYM8563TS
U26 = CON3_1
Y2 = CRYSTAL_2P_0: 无源晶振，32.768KHz，MC-146,±20ppm，12.5pF，Hosonic; Manufacturer PN: ETDE32.768W125BMPF; Manufacturer: Hosonic(鸿星电子); Priority: A; Created by: JJJ; Part Type: CRYSTAL; RK PN: ETDE32.768W125BMPF
*#5 = radxa_gong: Page Create Date: March  8, 1995

## Nets that join several sheets
GND: 04 (18 pins), 09 (38 pins), 13 (37 pins), 14 (13 pins)
VCC3V3_SYS: 09 (5 pins), 13 (5 pins), 14 (5 pins)
VCC5V0_USB: 13 (C99.1 U20.5), 14 (R211.1 R217.1)
VCC12V: 09 (C38.1 Q2.2 R36.1 R37.1), 14 (C126.1 C127.1 U26.2)